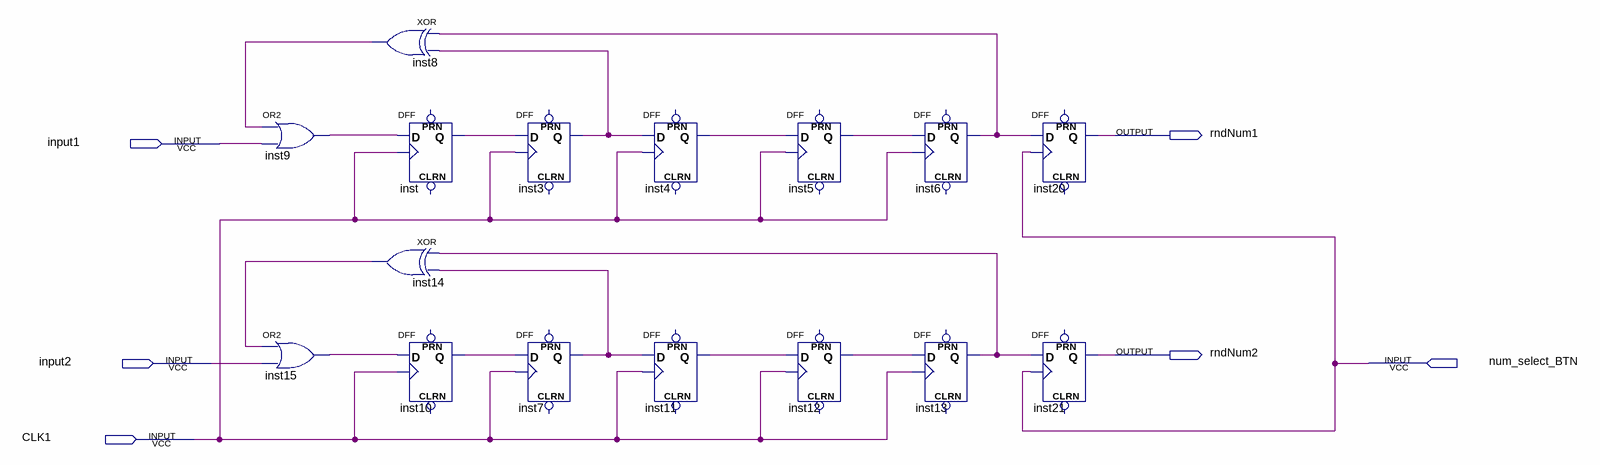
[diagram p0: schematic sheet]
// Quartus schematic Pseudo_rand_num_generator.bdf as structural Verilog: 16 symbols, 6 pins
module Pseudo_rand_num_generator (
  input  input1,
  input  input2,
  input  num_select_BTN,
  input  CLK1,
  output rndNum1,
  output rndNum2
);

  wire inst3_q, inst4_q, inst5_q, inst6_q, inst7_q, inst8_out, inst9_out, inst10_q, inst11_q, inst12_q,
       inst13_q, inst14_out, inst15_out, inst_q;

  or inst9 (inst9_out, inst8_out, input1);
  or inst15 (inst15_out, inst14_out, input2);
  xor inst8 (inst8_out, inst6_q, inst3_q);
  xor inst14 (inst14_out, inst13_q, inst7_q);
  DFF inst (.CLK(CLK1), .D(inst9_out), .Q(inst_q));  // open: CLRN, PRN
  DFF inst10 (.CLK(CLK1), .D(inst15_out), .Q(inst10_q));  // open: CLRN, PRN
  DFF inst3 (.CLK(CLK1), .D(inst_q), .Q(inst3_q));  // open: CLRN, PRN
  DFF inst7 (.CLK(CLK1), .D(inst10_q), .Q(inst7_q));  // open: CLRN, PRN
  DFF inst4 (.CLK(CLK1), .D(inst3_q), .Q(inst4_q));  // open: CLRN, PRN
  DFF inst11 (.CLK(CLK1), .D(inst7_q), .Q(inst11_q));  // open: CLRN, PRN
  DFF inst5 (.CLK(CLK1), .D(inst4_q), .Q(inst5_q));  // open: CLRN, PRN
  DFF inst12 (.CLK(CLK1), .D(inst11_q), .Q(inst12_q));  // open: CLRN, PRN
  DFF inst6 (.CLK(CLK1), .D(inst5_q), .Q(inst6_q));  // open: CLRN, PRN
  DFF inst13 (.CLK(CLK1), .D(inst12_q), .Q(inst13_q));  // open: CLRN, PRN
  DFF inst20 (.CLK(num_select_BTN), .D(inst6_q), .Q(rndNum1));  // open: CLRN, PRN
  DFF inst21 (.CLK(num_select_BTN), .D(inst13_q), .Q(rndNum2));  // open: CLRN, PRN
endmodule
